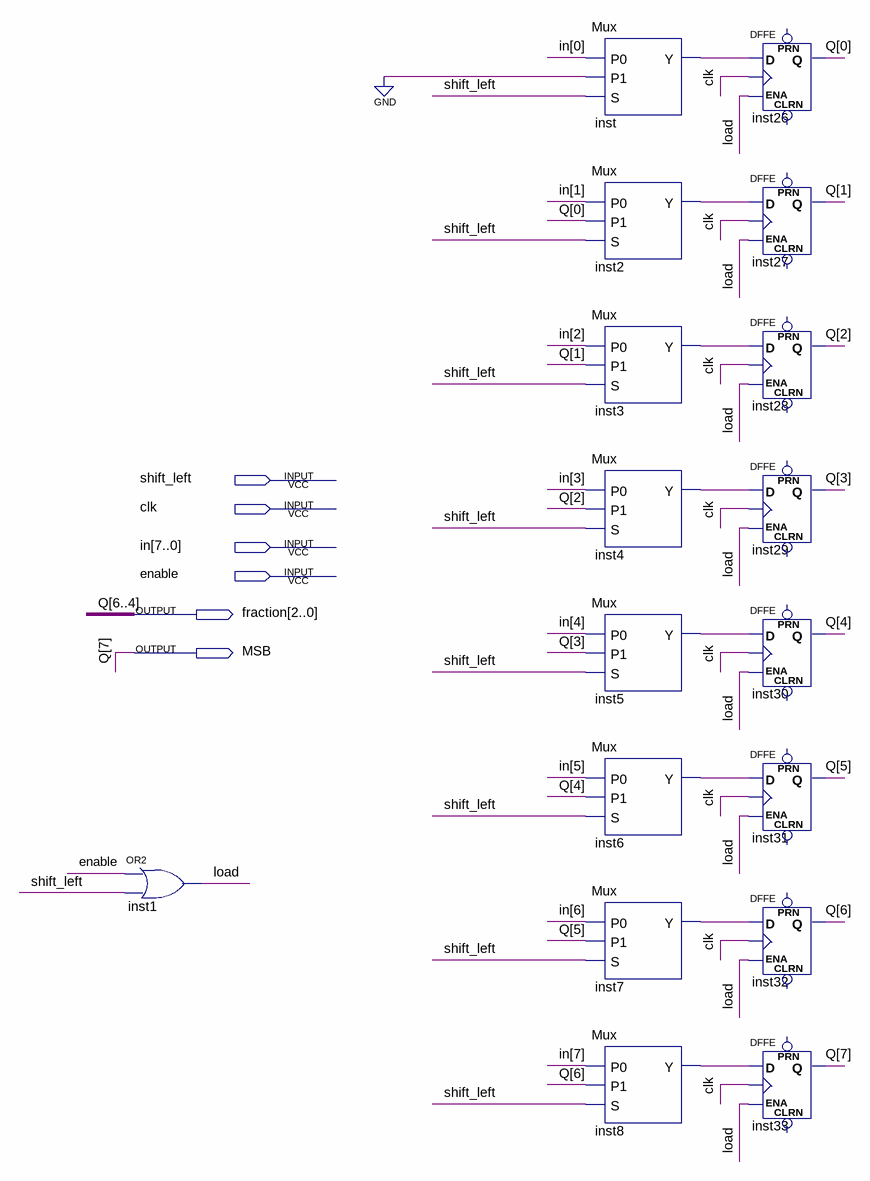
[diagram p0: schematic sheet]
// Quartus schematic fraction_register.bdf as structural Verilog: 17 symbols, 6 pins
module fraction_register (
  input  shift_left,
  input  clk,
  input  [7:0] in,
  input  enable,
  output [2:0] fraction,
  output MSB
);

  wire inst2_y, inst3_y, inst4_y, inst5_y, inst6_y, inst7_y, inst8_y, inst_y, load;
  wire [3:0] Q;

  or inst1 (load, enable, shift_left);
  Mux inst (.P0(in[0]), .P1(1'b0), .S(shift_left), .Y(inst_y));
  Mux inst2 (.P0(in[1]), .P1(Q[0]), .S(shift_left), .Y(inst2_y));
  Mux inst3 (.P0(in[2]), .P1(Q[1]), .S(shift_left), .Y(inst3_y));
  Mux inst4 (.P0(in[3]), .P1(Q[2]), .S(shift_left), .Y(inst4_y));
  Mux inst5 (.P0(in[4]), .P1(Q[3]), .S(shift_left), .Y(inst5_y));
  Mux inst6 (.P0(in[5]), .P1(fraction[0]), .S(shift_left), .Y(inst6_y));
  Mux inst7 (.P0(in[6]), .P1(fraction[1]), .S(shift_left), .Y(inst7_y));
  Mux inst8 (.P0(in[7]), .P1(fraction[2]), .S(shift_left), .Y(inst8_y));
  DFFE inst26 (.D(inst_y), .CLK(clk), .ENA(load), .Q(Q[0]));  // open: PRN, CLRN
  DFFE inst27 (.D(inst2_y), .CLK(clk), .ENA(load), .Q(Q[1]));  // open: PRN, CLRN
  DFFE inst28 (.D(inst3_y), .CLK(clk), .ENA(load), .Q(Q[2]));  // open: PRN, CLRN
  DFFE inst29 (.D(inst4_y), .CLK(clk), .ENA(load), .Q(Q[3]));  // open: PRN, CLRN
  DFFE inst30 (.D(inst5_y), .CLK(clk), .ENA(load), .Q(fraction[0]));  // open: PRN, CLRN
  DFFE inst31 (.D(inst6_y), .CLK(clk), .ENA(load), .Q(fraction[1]));  // open: PRN, CLRN
  DFFE inst32 (.D(inst7_y), .CLK(clk), .ENA(load), .Q(fraction[2]));  // open: PRN, CLRN
  DFFE inst33 (.D(inst8_y), .CLK(clk), .ENA(load), .Q(MSB));  // open: PRN, CLRN

  // Other names for the same wires on the sheet: Q[7:4] = {MSB, fraction}
endmodule
